# EAGLE design faboy (EAGLE 7.7.0)
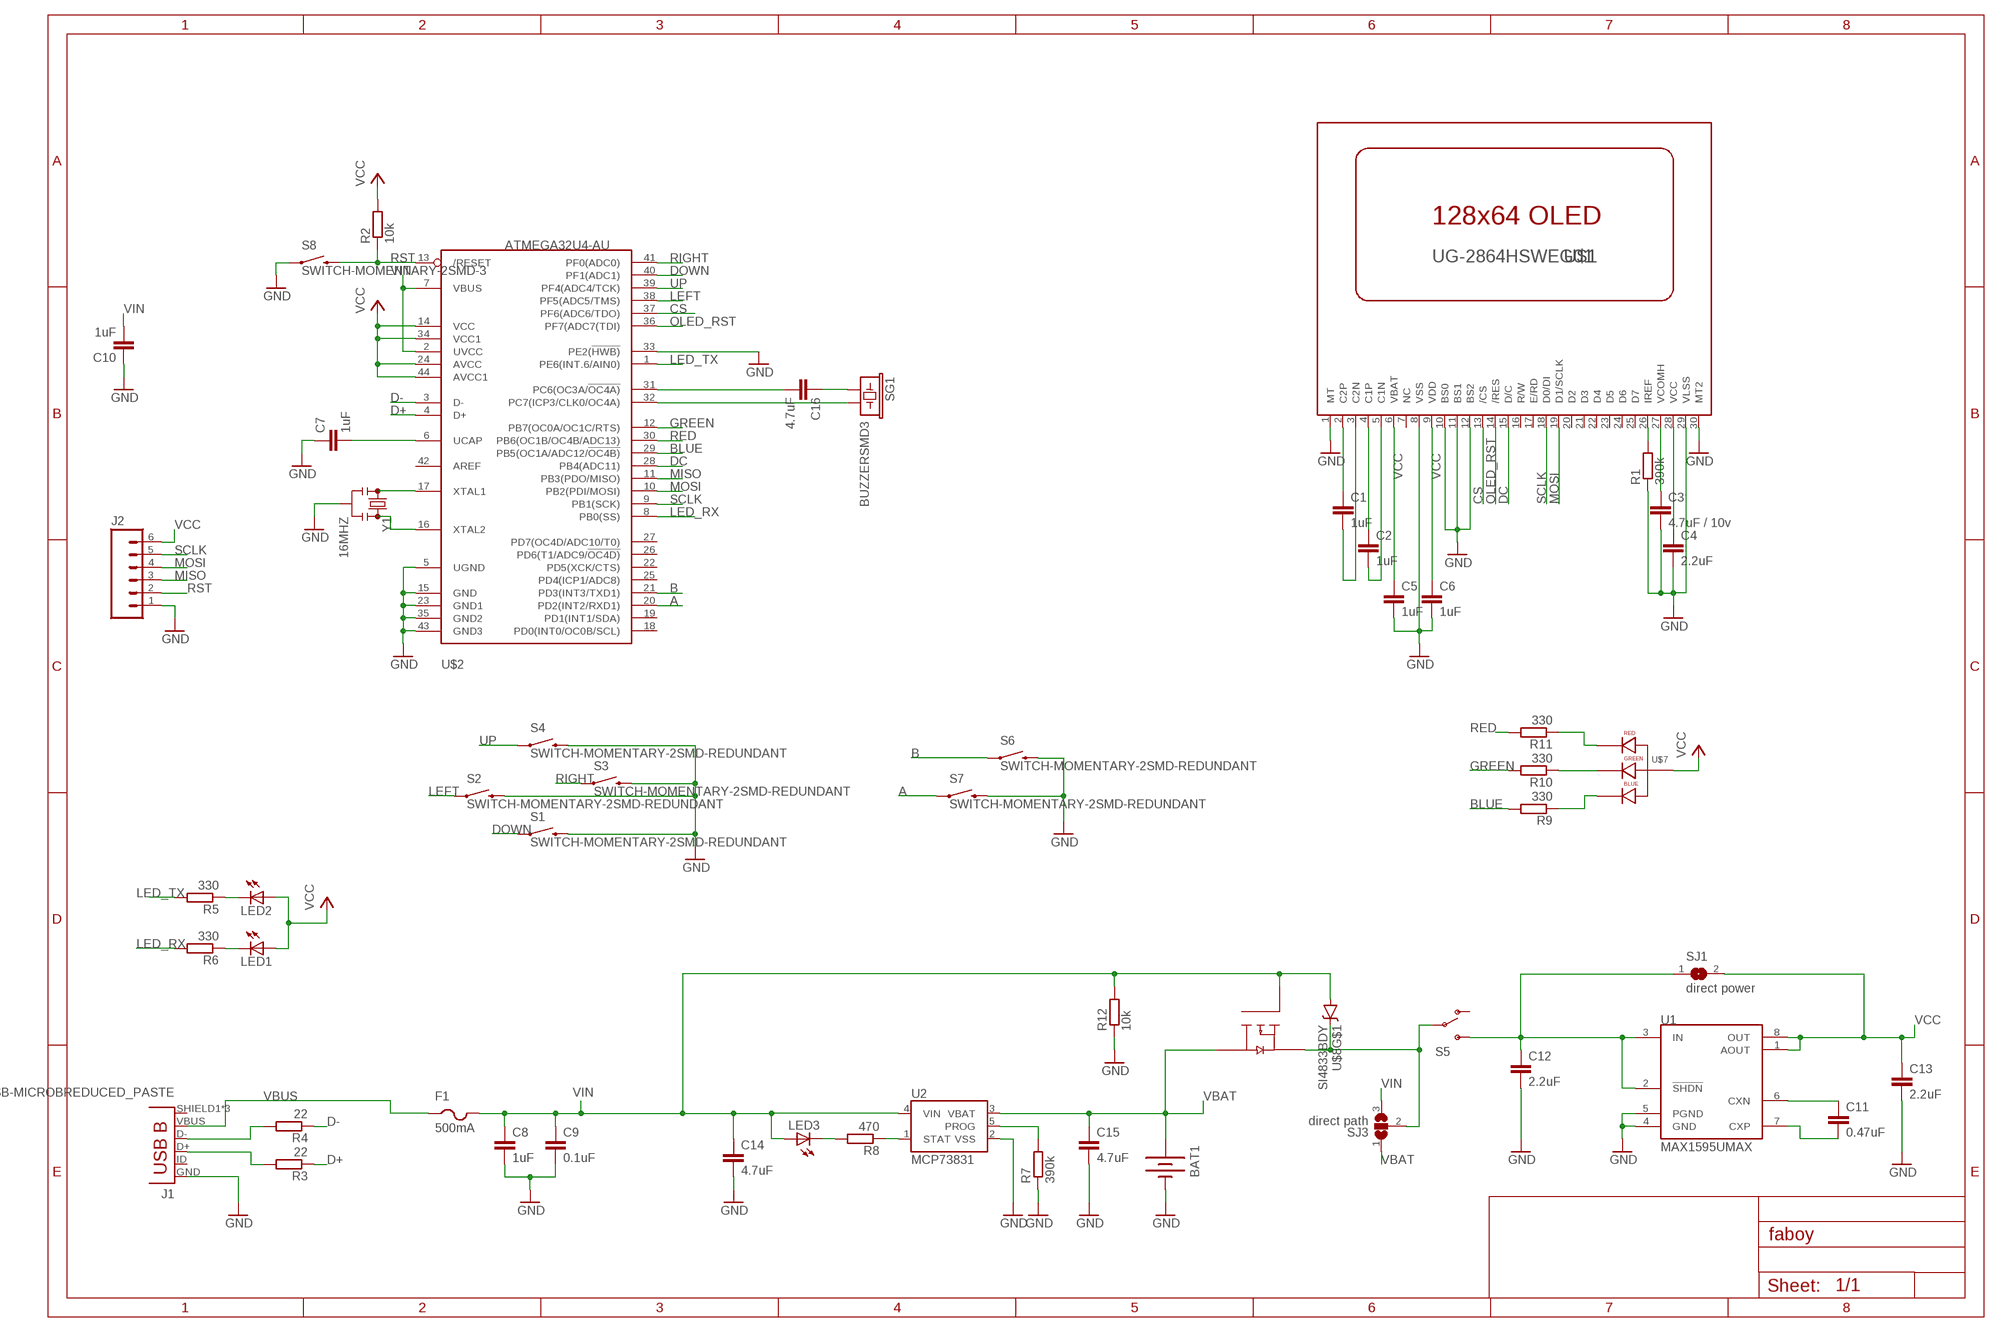
[diagram p0: schematic, sheet 1]

## Parts
BAT1  BATTERY20SMD  [BATTCON_20MM]
C1  1uF  C-EUC0805K  [C0805K]
C2  1uF  C-EUC0805K  [C0805K]
C3  4.7uF / 10v  C-EUC0805K  [C0805K]
C4  2.2uF  C-EUC0805K  [C0805K]
C5  1uF  C-EUC0805K  [C0805K]
C6  1uF  C-EUC0805K  [C0805K]
C7  1uF  C-EUC0805K  [C0805K]
C8  1uF  C-EUC0805K  [C0805K]
C9  0.1uF  C-EUC0805K  [C0805K]
C10  1uF  C-EUC0805K  [C0805K]
C11  0.47uF  C-EUC0805K  [C0805K]
C12  2.2uF  C-EUC0805K  [C0805K]
C13  2.2uF  C-EUC0805K  [C0805K]
C14  4.7uF  C-EUC0805K  [C0805K]
C15  4.7uF  C-EUC0805K  [C0805K]
C16  4.7uF  C-EUC0805K  [C0805K]
F1  500mA  PTCFUSE-1812  [1812]
J1  USB-MICROBREDUCED_PASTE  [USB-B-MICRO-SMD_V03_RED_PASTE]
J2  M06SMD-FEMALE-V2  [1X06-SMD-FEMALE-V2]
LED1  LEDSML0805  [SML0805]
LED2  LEDSML0805  [SML0805]
LED3  LEDSML0805  [SML0805]
R1  390k  R-EU_R0805  [R0805]
R2  10k  R-EU_R0805  [R0805]
R3  22  R-EU_R0805  [R0805]
R4  22  R-EU_R0805  [R0805]
R5  330  R-EU_R0805  [R0805]
R6  330  R-EU_R0805  [R0805]
R7  390k  R-EU_R0805  [R0805]
R8  470  R-EU_R0805  [R0805]
R9  330  R-EU_R0805  [R0805]
R10  330  R-EU_R0805  [R0805]
R11  330  R-EU_R0805  [R0805]
R12  10k  R-EU_R0805  [R0805]
S1  SWITCH-MOMENTARY-2SMD-REDUNDANT  [TACTILE-SWITCH-SMD]
S2  SWITCH-MOMENTARY-2SMD-REDUNDANT  [TACTILE-SWITCH-SMD]
S3  SWITCH-MOMENTARY-2SMD-REDUNDANT  [TACTILE-SWITCH-SMD]
S4  SWITCH-MOMENTARY-2SMD-REDUNDANT  [TACTILE-SWITCH-SMD]
S5  SWITCH-SPDT-SMD-A  [SWITCH-SPST-SMD-A]
S6  SWITCH-MOMENTARY-2SMD-REDUNDANT  [TACTILE-SWITCH-SMD]
S7  SWITCH-MOMENTARY-2SMD-REDUNDANT  [TACTILE-SWITCH-SMD]
S8  SWITCH-MOMENTARY-2SMD-3  [TACTILE_SWITCH_SMD-3]
SG1  BUZZERSMD3  [BUZZER-CMT1102]
SJ1  direct power  SJ  [SJ]
SJ3  direct path  SJ2W  [SJ_2]
U1  MAX1595UMAX  [UMAX8]
U2  MCP73831  [SOT23-5]
U$1  UG-2864HSWEG01  [1X30-0.7MM]
U$2  ATMEGA32U4-AU  [TQFP44]
U$7  LED-RGB-P-LCC-4  [P-LCC-4-3]
U$8  SI4833BDY  [SO08]
Y1  16MHZ  RESONATOR16MHZ  [RESONATOR-SMD]

## Nets
A: S7.1 S7.2 U$2.20(PD2(INT2/RXD1))
B: S6.1 S6.2 U$2.21(PD3(INT3/TXD1))
BLUE: R9.2 U$2.29(PB5(OC1A/ADC12/!OC4B))
CS: U$1.13(/CS) U$2.37(PF6(ADC6/TDO))
D+: R3.1 U$2.4(D+)
D-: R4.1 U$2.3(D-)
DC: U$1.15(D/C) U$2.28(PB4(ADC11))
DOWN: S1.1 S1.2 U$2.40(PF1(ADC1))
GND: BAT1.2(-) C3.2 C4.2 C5.2 C6.2 C7.1 C8.2 C9.2 C10.1 C12.2 C13.2 C14.2 C15.2 J1.GND J2.1 R1.1 R7.1 R12.1 S1.3 S1.4 S2.3 S2.4 S3.3 S3.4 S4.3 S4.4 S6.3 S6.4 S7.3 S7.4 S8.1 U1.4(GND) U1.5(PGND) U2.2(VSS) U$1.1(MT) U$1.8(VSS) U$1.10(BS0) U$1.11(BS1) U$1.12(BS2) U$1.29(VLSS) U$1.30(MT2) U$2.5(UGND) U$2.15(GND) U$2.23(GND1) U$2.33(PE2(!HWB)) U$2.35(GND2) U$2.43(GND3) Y1.2
GREEN: R10.2 U$2.12(PB7(OC0A/OC1C/RTS))
LED_RX: R6.2 U$2.8(PB0(SS))
LED_TX: R5.2 U$2.1(PE6(INT.6/AIN0))
LEFT: S2.1 S2.2 U$2.38(PF5(ADC5/TMS))
MISO: J2.3 U$2.11(PB3(PDO/MISO))
MOSI: J2.4 U$1.19(D1/SCLK) U$2.10(PB2(PDI/MOSI))
N$1: C1.1 U$1.2(C2P)
N$2: C1.2 U$1.3(C2N)
N$3: C2.1 U$1.4(C1P)
N$4: C2.2 U$1.5(C1N)
N$5: R1.2 U$1.26(IREF)
N$6: R11.1 U$7.1(RED_CATHODE)
N$7: C3.1 U$1.27(VCOMH)
N$8: C4.1 U$1.28(VCC)
N$9: C7.2 U$2.6(UCAP)
N$10: C12.1 S5.3(S) SJ1.1 U1.2(!SHDN) U1.3(IN)
N$11: U$2.17(XTAL1) Y1.1
N$12: J1.D+ R3.2
N$13: J1.D- R4.2
N$14: U$2.16(XTAL2) Y1.3
N$15: C11.1 U1.6(CXN)
N$16: C11.2 U1.7(CXP)
N$17: R8.1 U2.1(STAT)
N$18: LED3.C R8.2
N$19: R7.2 U2.5(PROG)
N$20: C16.2 U$2.31(PC6(OC3A/!OC4A))
N$21: C16.1 SG1.1
N$22: R10.1 U$7.4(GREEN_CATHODE)
N$23: LED2.C R5.1
N$24: R9.1 U$7.3(BLUE_CATHODE)
N$25: LED1.C R6.1
N$26: SG1.2 U$2.32(PC7(ICP3/CLK0/OC4A))
N$28: S5.2(P) SJ3.2 U$8.3(S2) U$8.7(C) U$8.8(C)
OLED_RST: U$1.14(/RES) U$2.36(PF7(ADC7(TDI))
RED: R11.2 U$2.30(PB6(OC1B/OC4B/ADC13))
RIGHT: S3.1 S3.2 U$2.41(PF0(ADC0))
RST: J2.2 R2.1 S8.4 U$2.13(/RESET)
SCLK: J2.5 U$1.18(D0/DI) U$2.9(PB1(SCK))
UP: S4.1 S4.2 U$2.39(PF4(ADC4/TCK))
VBAT: BAT1.1(+) C15.1 SJ3.1 U2.3(VBAT) U$8.5(D2) U$8.6(D2)
VBUS: F1.1 J1.VBUS
VCC: C5.1 C6.1 C13.1 J2.6 LED1.A LED2.A R2.2 SJ1.2 U1.1(AOUT) U1.8(OUT) U$1.6(VBAT) U$1.9(VDD) U$2.14(VCC) U$2.24(AVCC) U$2.34(VCC1) U$2.44(AVCC1) U$7.2(ANODE)
VIN: C8.1 C9.1 C10.2 C14.1 F1.2 LED3.A R12.2 SJ3.3 U2.4(VIN) U$2.2(UVCC) U$2.7(VBUS) U$8.1(A) U$8.2(A) U$8.4(G2)
Unconnected: J1.ID(USBID) J1.SHIELD1(SHIELD) J1.SHIELD2(SHIELD) J1.SHIELD3(SHIELD) S5.1(O) U$1.7(NC) U$1.16(R/W) U$1.17(E/RD) U$1.20(D2) U$1.21(D3) U$1.22(D4) U$1.23(D5) U$1.24(D6) U$1.25(D7) U$2.18(PD0(INT0/OC0B/SCL)) U$2.19(PD1(INT1/SDA)) U$2.22(PD5(XCK/CTS)) U$2.25(PD4(ICP1/ADC8)) U$2.26(PD6(T1/ADC9/!OC4D)) U$2.27(PD7(OC4D/ADC10/T0)) U$2.42(AREF)

## Library data of the parts
BAT1 = SparkFun-Electromechanical:BATTERY: Battery Holders Various common sizes : AA, AAA, 18650 (PRT-12895), 20mm coin cell and 12mm coin cell. 20MM_4LEGS, BATT-10373
C1-C16 = resistor:C-EU: CAPACITOR, European symbol
F1 = adafruit:PTCFUSE: PTC fuses, resettable thermistors
J1 = SparkFun-Connectors:USB-MICROB: RED_PASTE version has 70% paste area under D+ D- USBID pins for applications where those pins aren't required, to reduce the likelihood of bridges.; PROD_ID: CONN-11752
J2 = SparkFun-Connectors:M06: Header 6 Standard 6-pin 0.1" header. Use with straight break away headers (SKU : PRT-00116), right angle break away headers (PRT-00553), swiss pins (PRT-00743), machine pins (PRT-00117), and female headers (PRT-00115). Molex polarized connector foot print use with SKU : PRT-08094 with associated crimp pins and housings. NOTES ON THE VARIANTS LOCK and LOCK_LONGPADS... This footprint was designed to help hold the alignment of a through-hole component (i.e. 6-pin header) while soldering it into place. You may notice that each hole has been shifted either up or down by 0.005 of an inch from it's more standard position (which is a perfectly straight line). This slight alteration caused the pins (the squares in the middle) to touch the edges of the holes. Because they are alternating, it causes a "brace" to hold the component in place. 0.005 has proven to be the perfect amount of "off-center" position when using our standard breakaway headers. Although looks a little odd when you look at the bare footprint, once you have a header in there, the alteration is very hard to notice. Also,if you push a header all the way into place, it is covered up entirely on the bottom side. This idea of altering the position of holes to aid alignment will be further integrated into the Sparkfun Library for other footprints. It can help hold any component with 3 or more connection pins.; PROD_ID: CONN-09668
LED1-LED3 = led:LED: LED OSRAM: - CHIPLED LG R971, LG N971, LY N971, LG Q971, LY Q971, LO R971, LY R971 LH N974, LH R974 LS Q976, LO Q976, LY Q976 LO Q996 - Hyper CHIPLED LW Q18S LB Q993, LB Q99A, LB R99A - SideLED LS A670, LO A670, LY A670, LG A670, LP A670 LB A673, LV A673, LT A673, LW A673 LH A674 LY A675 LS A676, LA A676, LO A676, LY A676, LW A676 LS A679, LY A679, LG A679 - Hyper Micro SIDELED® LS Y876, LA Y876, LO Y876, LY Y876 LT Y87S - SmartLED LW L88C, LW L88S LB L89C, LB L89S, LG L890 LS L89K, LO L89K, LY L89K LS L896, LA L896, LO L896, LY L896 - TOPLED LS T670, LO T670, LY T670, LG T670, LP T670 LSG T670, LSP T670, LSY T670, LOP T670, LYG T670 LG T671, LOG T671, LSG T671 LB T673, LV T673, LT T673, LW T673 LH T674 LS T676, LA T676, LO T676, LY T676, LB T676, LH T676, LSB T676, LW T676 LB T67C, LV T67C, LT T67C, LS T67K, LO T67K, LY T67K, LW E67C LS E67B, LA E67B, LO E67B, LY E67B, LB E67C, LV E67C, LT E67C LW T67C LS T679, LY T679, LG T679 LS T770, LO T770, LY T770, LG T770, LP T770 LB T773, LV T773, LT T773, LW T773 LH T774 LS E675, LA E675, LY E675, LS T675 LS T776, LA T776, LO T776, LY T776, LB T776 LHGB T686 LT T68C, LB T68C - Hyper Mini TOPLED® LB M676 - Mini TOPLED Santana® LG M470 LS M47K, LO M47K, LY M47K Source: http://www.osram.convergy.de LUXEON: - LUMILED® LXK2-PW12-R00, LXK2-PW12-S00, LXK2-PW14-U00, LXK2-PW14-V00 LXK2-PM12-R00, LXK2-PM12-S00, LXK2-PM14-U00 LXK2-PE12-Q00, LXK2-PE12-R00, LXK2-PE12-S00, LXK2-PE14-T00, LXK2-PE14-U00 LXK2-PB12-K00, LXK2-PB12-L00, LXK2-PB12-M00, LXK2-PB14-N00, LXK2-PB14-P00, LXK2-PB14-Q00 LXK2-PR12-L00, LXK2-PR12-M00, LXK2-PR14-Q00, LXK2-PR14-R00 LXK2-PD12-Q00, LXK2-PD12-R00, LXK2-PD12-S00 LXK2-PH12-R00, LXK2-PH12-S00 LXK2-PL12-P00, LXK2-PL12-Q00, LXK2-PL12-R00 Source: www.luxeon.com KINGBRIGHT: KA-3528ASYC Source: www.kingbright.com
R1-R12 = resistor:R-EU_: RESISTOR, European symbol
S1-S4 S6 S7 = SparkFun-Electromechanical:SWITCH-MOMENTARY-2: Various NO switches- pushbuttons, reed, etc; PROD_ID: SWCH-08247
S5 = SparkFun-Electromechanical:SWITCH-SPDT: SPDT Switch Simple slide switch, Spark Fun Electronics SKU : COM-00102 DPDT SMT slide switch, AYZ0202, SWCH-08179; PROD_ID: SWCH-10651
S8 = SparkFun-Electromechanical:SWITCH-MOMENTARY-2: Various NO switches- pushbuttons, reed, etc
SG1 = SparkFun-Electromechanical:BUZZER: Buzzer 12mm Spark Fun Electronics SKU : Comp-Buzzer
SJ1 = jumper:SJ: SMD solder JUMPER
SJ3 = jumper:SJ2W: SMD solder JUMPER
U1 = maxim:MAX1595: max1595 buck/boost dcdc 3.3v output
U2 = SparkFun-PowerIC:MCP73831: Miniature single cell, fully integrated Li-Ion, Li-polymer charge management controller http://ww1.microchip.com/downloads/en/DeviceDoc/20001984g.pdf IC-09995; PROD_ID: IC-09995
U$1 = adafruit:UG-2864HSWEG01: UG-2864HSWEG01 OLED display
U$2 = adafruit:ATMEGA32U4: http://www.ladyada.net/library/eagle
U$7 = SparkFun-LED:LED-RGB-P-LCC-4
U$8 = SparkFun-DiscreteSemi:SI4833BDY
Y1 = SparkFun-FreqCtrl:RESONATOR: Resonator Small SMD resonator. Used, eg, on the Arduino Pro/ Pro Mini boards. 8MHz- XTAL-08895 16MHz- XTAL-08900; PROD_ID: XTAL-08900

## Board
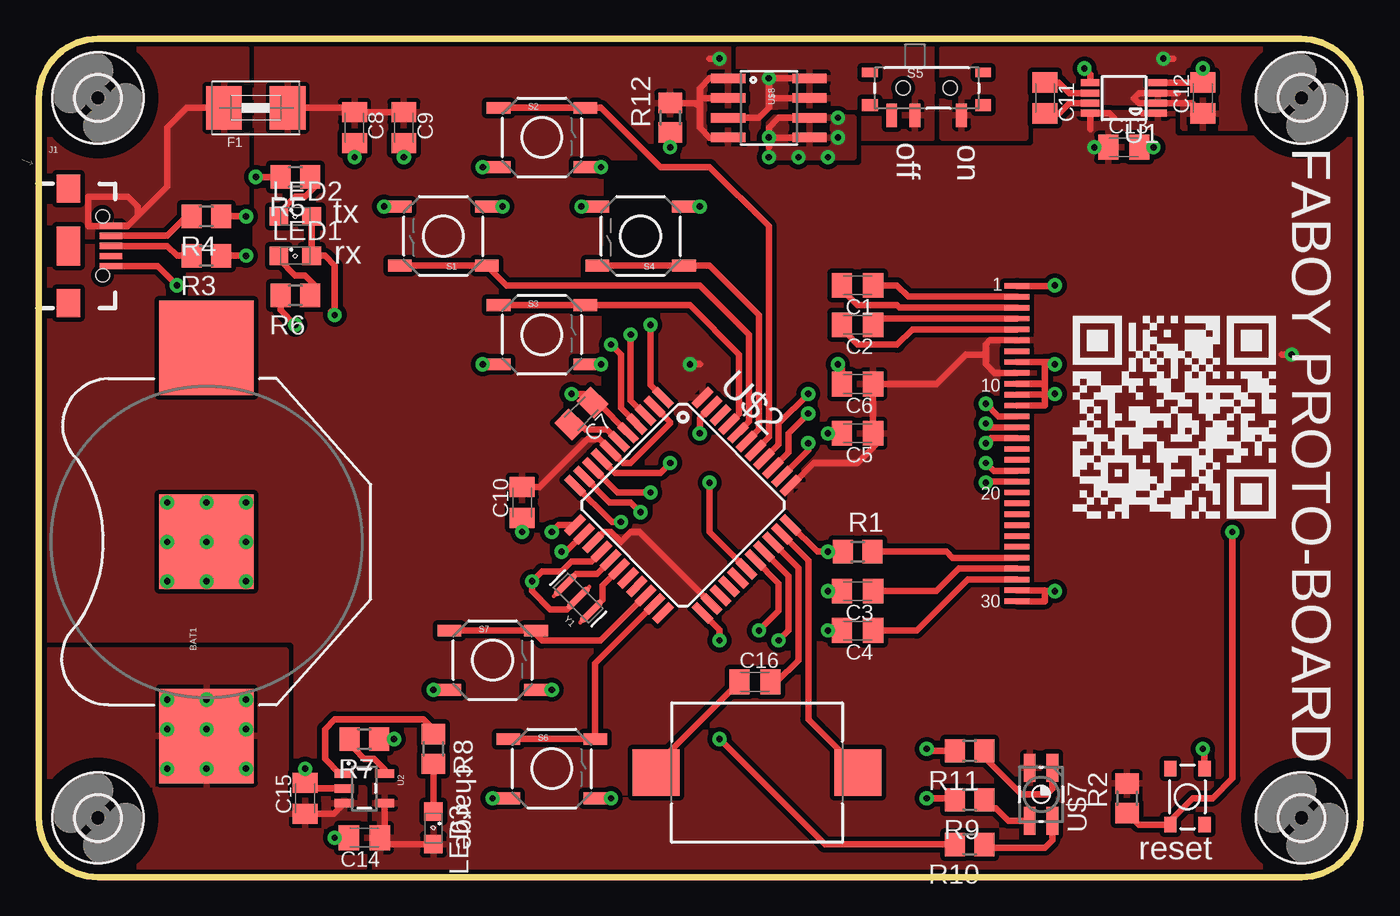
[diagram p1: board, top side]
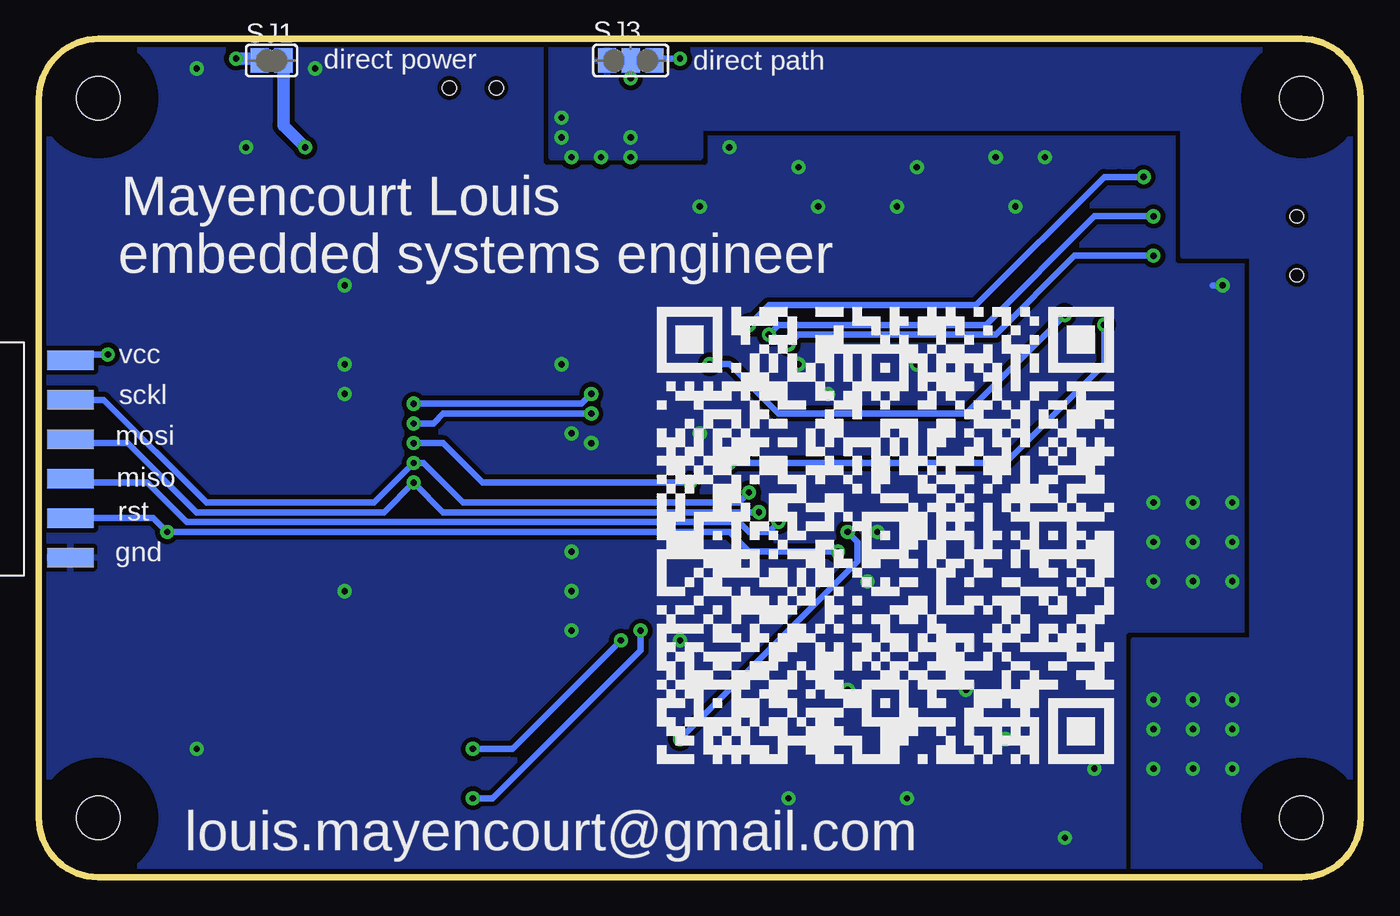
[diagram p2: board, bottom side, seen from below]

Size 85.09 x 53.98 mm. Coordinates in mm from the lower left corner, seen from the top.
Outline: 81.23,53.98 3.81,53.98 arc90 0,50.16 0,3.81 arc90 3.81,0 81.28,0 arc90 85.09,3.81 85.09,50.11 arc90 81.23,53.98
Copper layers (1*16): Top 0.035mm / dielectric 1.5mm / Bottom 0.035mm
Design rules "SparkFun": minimum track width 8mil, minimum drill 20mil, track to track 8mil, track to pad 8mil, pad to pad 8mil, via to via 8mil, smd to smd 8mil, copper to edge 8mil, drill to drill 8mil, minimum pad ring 12mil, minimum via ring 10mil, stop-mask expansion 4mil, vias tented up to drill 20mil, thermal gap 10mil

### Footprints (pad centres in the part's own frame; a part is rotated, then mirrored left to right if it is on the bottom)
BATTCON_20MM = smd 6.07 x 6.07: 1 -12.5,0; 2 0,0; 3 12.5,0
C0805K = smd 1.3 x 1.6: 1 -1,0; 2 1,0
1812 = smd 2.286 x 2.794: 1 -2.046,0; 2 2.046,0
USB-B-MICRO-SMD_V03_RED_PASTE = smd 1.45 x 0.4: D+ 2.725,0; D- 2.725,0.65; GND 2.725,-1.3; ID 2.725,-0.65; VBUS 2.725,1.3 | smd 1.5 x 1.8: SHIELD1 0,3.685; SHIELD2 0,-3.685 | smd 1.5 x 2.5: SHIELD3 0,0 | hole 0.85: 2.2,1.9; 2.2,-1.9
1X06-SMD-FEMALE-V2 = smd 1.25 x 3: 1 6.35,3.425; 2 3.81,3.425; 3 1.27,3.425; 4 -1.27,3.425; 5 -3.81,3.425; 6 -6.35,3.425
SML0805 = smd 1.2 x 1.2: A 1.05,0; C -1.05,0
R0805 = smd 1.3 x 1.5: 1 -0.95,0; 2 0.95,0
TACTILE-SWITCH-SMD = smd 1.524 x 0.762: 1 -2.794,1.905; 2 2.794,1.905; 3 -2.794,-1.905; 4 2.794,-1.905
SWITCH-SPST-SMD-A = smd 0.7 x 1.5: 1 -2.25,-1.75; 2 -0.75,-1.75; 3 2.25,-1.75 | smd 1 x 0.6: GND1 -3.65,1; GND3 3.65,1 | smd 1 x 0.8: GND2 -3.65,-1.1; GND4 3.65,-1.1 | hole 0.9: -1.5,0; 1.5,0
TACTILE_SWITCH_SMD-3 = smd 1 x 0.8: 1 -1.8,1.1; 2 1.8,1.1; 3 -1.8,-1.1; 4 1.8,-1.1
BUZZER-CMT1102 = smd 3 x 3: 1 -6.5,0; 2 6.5,0
SJ = smd 1.168 x 1.6: 1 -0.762,0; 2 0.762,0
SJ_2 = smd 1.168 x 1.6: 1 -1.524,0; 2 0,0; 3 1.524,0
UMAX8 = smd 0.45 x 1.2: 1 -0.975,-2.175; 2 -0.325,-2.175; 3 0.325,-2.175; 4 0.975,-2.175; 5 0.975,2.175; 6 0.325,2.175; 7 -0.325,2.175; 8 -0.975,2.175
SOT23-5 = smd 0.55 x 1.2: 1 -0.95,-1.3; 2 0,-1.3; 3 0.95,-1.3; 4 0.95,1.3; 5 -0.95,1.3
1X30-0.7MM = smd 0.35 x 1.6: 1 -10.15,0; 2 -9.45,0; 3 -8.75,0; 4 -8.05,0; 5 -7.35,0; 6 -6.65,0; 7 -5.95,0; 8 -5.25,0; 9 -4.55,0; 10 -3.85,0; 11 -3.15,0; 12 -2.45,0; 13 -1.75,0; 14 -1.05,0; 15 -0.35,0; 16 0.35,0; 17 1.05,0; 18 1.75,0; 19 2.45,0; 20 3.15,0; 21 3.85,0; 22 4.55,0; 23 5.25,0; 24 5.95,0; 25 6.65,0; 26 7.35,0; 27 8.05,0; 28 8.75,0; 29 9.45,0; 30 10.15,0
TQFP44 = smd 1.5 x 0.5: 1 -5.8,4; 2 -5.8,3.2; 3 -5.8,2.4; 4 -5.8,1.6; 5 -5.8,0.8; 6 -5.8,0; 7 -5.8,-0.8; 8 -5.8,-1.6; 9 -5.8,-2.4; 10 -5.8,-3.2; 11 -5.8,-4; 23 5.8,-4; 24 5.8,-3.2; 25 5.8,-2.4; 26 5.8,-1.6; 27 5.8,-0.8; 28 5.8,0; 29 5.8,0.8; 30 5.8,1.6; 31 5.8,2.4; 32 5.8,3.2; 33 5.8,4 | smd 0.5 x 1.5: 12 -4,-5.8; 13 -3.2,-5.8; 14 -2.4,-5.8; 15 -1.6,-5.8; 16 -0.8,-5.8; 17 0,-5.8; 18 0.8,-5.8; 19 1.6,-5.8; 20 2.4,-5.8; 21 3.2,-5.8; 22 4,-5.8; 34 4,5.8; 35 3.2,5.8; 36 2.4,5.8; 37 1.6,5.8; 38 0.8,5.8; 39 0,5.8; 40 -0.8,5.8; 41 -1.6,5.8; 42 -2.4,5.8; 43 -3.2,5.8; 44 -4,5.8
2,8 = hole 2.8: 0,0
P-LCC-4-3 = smd 0.75 x 1.8: 1 0.725,1.7; 2 -0.725,1.7; 3 -0.725,-1.7; 4 0.725,-1.7
SO08 = smd 0.61 x 2.21: 1 -1.905,-2.616; 2 -0.635,-2.616; 3 0.635,-2.616; 4 1.905,-2.616; 5 1.905,2.616; 6 0.635,2.616; 7 -0.635,2.616; 8 -1.905,2.616
RESONATOR-SMD = smd 0.45 x 1.905: 1 -1.2,0; 2 0,0; 3 1.2,0

### Placement (x,y rotation side)
BAT1  10.79,21.59 90 top
C1  52.7,38.1 180 top
C2  52.7,35.56 180 top
C3  52.7,18.41 180 top
C4  52.7,15.88 180 top
C5  52.7,28.57 180 top
C6  52.7,31.75 180 top
C7  34.92,29.84 225 top
C8  20.32,48.26 270 top
C9  23.5,48.26 270 top
C10  31.11,24.13 90 top
C11  64.77,50.16 270 top
C12  74.93,50.16 90 top
C13  69.85,46.99 0 top
C14  20.95,2.54 180 top
C15  17.14,5.08 90 top
C16  46.1,12.57 0 top
F1  13.97,49.53 0 top
J1  1.91,40.64 0 top
J2  86.49,26.92 270 bottom
LED1  16.51,40.01 0 top
LED2  16.51,42.55 0 top
LED3  25.4,3.17 270 top
R1  52.7,20.95 0 top
R2  70.05,5.08 90 top
R3  10.79,40.01 180 top
R4  10.79,42.55 180 top
R5  820  [R0805]  16.51,45.09 180 top
R6  820  [R0805]  16.51,37.47 180 top
R7  20.95,8.89 180 top
R8  25.4,8.26 270 top
R9  820  [R0805]  59.92,4.98 180 top
R10  820  [R0805]  59.92,2.11 180 top
R11  820  [R0805]  59.92,8.13 180 top
R12  40.64,48.9 90 top
S1  26.04,41.27 180 top
S2  32.38,47.62 0 top
S3  32.38,34.92 0 top
S4  38.73,41.27 180 top
S5  57.15,50.8 0 top
S6  33.02,6.99 0 top
S7  29.21,13.97 0 top
S8  73.94,5.18 270 top
SG1  46.23,6.73 0 top
SJ1  70.1,52.58 0 bottom
SJ3  46.99,52.58 0 bottom
U1  69.85,50.16 90 top
U2  20.95,5.71 270 top
U$1  62.97,27.91 270 top
U$2  41.46,23.94 315 top
U$3  [2,8]  81.28,50.16 270 top
U$4  [2,8]  81.28,3.81 270 top
U$5  gnd  [2,8]  3.81,50.16 270 top
U$6  [2,8]  3.81,3.81 270 top
U$7  64.52,5.33 0 top
U$8  46.99,49.53 270 top
Y1  34.72,17.97 135 top

### Tracks (layer width: path | path; a pad name or v marks a point on that pad's centre or on a via)
A
  Top 0.406: S7.1 S7.2 32,15.62 32.38,15.24 36.15,15.24 U$2.20
B
  Top 0.406: S6.1 S6.2 35.81,13.77 U$2.21
BLUE  (via drill 0.4)
  Top 0.406: v46.35,15.88 47.62,17.14 47.62,18.91 U$2.29 | v57.15,5.08 58.87,5.08 R9.2
  Bottom 0.406: v46.35,15.88 46.35,14.61 55.88,5.08 v57.15,5.08
CS  (via drill 0.4)
  Top 0.406: U$2.37 47.62,27.84 47.62,29.21 v49.53,31.11 | v60.96,30.48 61.77,29.66 U$1.13
  Bottom 0.406: v49.53,31.11 50.16,30.48 v60.96,30.48
D+  (via drill 0.4)
  Top 0.406: U$2.4 37.47,30.2 37.47,33.66 v36.83,34.29 | v13.34,40.01 R3.1
  Bottom 0.406: v36.83,34.29 36.2,34.92 23.5,34.92 18.41,40.01 v13.34,40.01
D-  (via drill 0.4)
  Top 0.406: U$2.3 38.1,30.7 v38.1,34.92 | v13.34,42.55 R4.1
  Bottom 0.406: v38.1,34.92 37.47,35.56 24.13,35.56 17.14,42.55 v13.34,42.55
DC  (via drill 0.4)
  Top 0.406: U$2.28 43.18,22.23 v43.18,25.4 | v60.96,27.94 61.28,28.27 U$1.15
  Bottom 0.406: v43.18,25.4 56.52,25.4 59.05,27.94 v60.96,27.94
DOWN
  Top 0.406: S1.2 S1.1 30.1,38.1 42.55,38.1 45.72,34.92 45.72,29.33 U$2.40
GND  (via drill 0.4)
  Top 0.406: U$1.30 64.75,17.77 64.77,17.78 64.77,18.41 | 64.77,18.41 64.72,18.46 U$1.29 | U$1.8 64.77,33.16 | 64.77,33.16 64.77,31.75 | 64.77,31.75 62.97,31.75 U$1.10 64.75,31.77 64.77,31.75 | U$1.11 64.77,31.07 | U$1.12 64.77,30.36 64.77,31.07 | U1.4 74.64,51.14 | C12.2 74.91,51.14 74.64,51.14 | 64.77,18.41 v65.41,18.41 | C13.2 v71.75,46.99 | 74.64,51.14 arc90 v74.93,52.07 | 64.77,31.07 64.82,31.11 v65.41,31.11 64.77,31.11 64.77,31.75 | 64.77,33.16 65.26,33.16 v65.41,33.02 | 34.01,17.25 32.92,17.25 31.75,18.41 v31.75,19.05 32.38,19.68 33.66,19.68 34.29,20.32 35.57,20.32 U$2.15 | C10.1 v31.11,22.23 | C7.1 35.63,30.41 | U1.5 67.67,51.7 v67.31,52.07 | C8.2 v20.32,46.35 | S2.4 v36.2,45.72 | S2.3 v28.57,45.72 | S6.3 v29.21,5.08 | S6.4 v36.83,5.08 | S1.4 v22.23,43.18 | S1.3 v29.84,43.18 | S4.4 v34.92,43.18 | S4.3 v42.55,43.18 | v28.57,33.02 S3.3 | v36.2,33.02 S3.4 | S7.3 v25.4,12.06 | S7.4 v33.02,12.06 | C7.1 35.07,31.11 v34.29,31.11 | C6.2 51.7,32.75 v51.44,33.02 | U$1.1 65.37,38.06 v65.41,38.1 | C3.2 v50.8,18.41 | R1.1 v50.8,20.95 50.11,20.95 U$2.33 | C4.2 v50.8,15.88 | C9.2 v23.5,46.35 | S8.1 75.04,8.15 v74.93,8.26 | U2.2 17.51,5.71 C15.2 v17.14,6.99 | C14.2 v19.05,2.54 | R7.1 v22.86,8.89 | U$2.35 49.53,27.49 v49.53,27.94 | C5.2 v50.8,28.57 | U$2.5 35.98,30.55 C7.1 | U$2.23 43.81,15.93 v43.81,15.24 | R12.1 v40.64,46.99 | U$2.43 42.55,29.55 v42.55,28.57 | J1.GND 7.65,39.34 v8.89,38.1
  Bottom 0.406: v42.55,28.57 42.55,27.94 | v8.89,38.1 9.53,38.1
  other vias: 8.26,24.13 10.79,24.13 13.34,24.13 13.34,21.59 13.34,19.05 10.79,21.59 8.26,21.59 10.79,19.05 8.26,19.05
  pour Bottom (isolate 0.305, rank 2): 0.64,53.34 84.45,53.34 84.45,0.64 0.64,0.64
  pour Bottom (isolate 0.305, rank 2): 0.64,53.34 84.45,53.34 84.45,0.64 0.64,0.64
GREEN  (via drill 0.4)
  Top 0.406: U$2.12 33.47,22.67 v33.02,22.23 | v43.81,8.89 50.6,2.11 R10.2
  Bottom 0.406: v33.02,22.23 32.38,21.59 32.38,20.32 v43.81,8.89
LED_RX  (via drill 0.4)
  Top 0.406: U$2.8 37.11,26.04 40.01,26.04 v40.64,26.67 | R6.2 15.56,36.51 v16.51,35.56
  Bottom 0.406: v40.64,26.67 22.86,26.67 16.51,33.02 v16.51,35.56
LED_TX  (via drill 0.4)
  Top 0.406: U$2.1 39.37,31.69 v39.37,35.56 | 15.56,45.41 R5.2 v13.97,45.09
  Bottom 0.406: v39.37,35.56 38.1,36.83 24.77,36.83 16.51,45.09 R5.2 v13.97,45.09
LEFT
  Top 0.406: S2.1 S2.2 36.2,49.53 40.01,45.72 43.18,45.72 46.99,41.91 46.99,28.34 U$2.38
MISO  (via drill 0.4)
  Top 0.406: U$2.11 36.89,22.86 v37.47,22.86
  Bottom 0.406: v37.47,22.86 38.1,22.23 39.37,22.23 40.01,22.86 75.56,22.86 78.11,25.4 82.81,25.4 J2.3
MOSI  (via drill 0.4)
  Top 0.406: U$2.10 36.75,24.13 38.1,24.13 v38.73,23.5 | v60.96,25.4 61.02,25.46 U$1.19
  Bottom 0.406: v38.73,23.5 59.05,23.5 v60.96,25.4 62.87,23.5 74.93,23.5 79.38,27.94 82.81,27.94 J2.4
N$1
  Top 0.406: U$1.2 55.98,37.37 55.24,38.1 C1.1
N$2
  Top 0.406: U$1.3 55.41,36.66 55.24,36.83 52.7,36.83 51.7,37.83 C1.2
N$3
  Top 0.406: U$1.4 54.11,35.97 C2.1
N$4
  Top 0.406: U$1.5 56.22,35.27 55.24,34.29 52.7,34.29 52.07,34.92 52.07,35.2 C2.2
N$5
  Top 0.406: U$1.26 58.81,20.57 58.42,20.95 R1.2
N$6
  Top 0.406: U$7.1 65.24,5.68 64.9,5.33 63.25,5.33 60.96,7.62 60.96,8.04 R11.1
N$7
  Top 0.406: U$1.27 59.23,19.86 57.78,18.41 C3.1
N$8
  Top 0.406: U$1.28 59.8,19.16 56.52,15.88 C4.1
N$9
  Top 0.406: U$2.6 36.58,28.83 35.18,28.83 34.87,29.14 C7.2
N$10  (via drill 0.4)
  Top 0.406: C12.1 74.25,49.84 U1.2 70.81,49.84 70.48,50.16 70.81,50.49 U1.3 73.33,50.49 | v72.39,52.7 73.03,52.7
  Bottom 0.813: SJ1.1 70.99,52.7 v72.39,52.7
  pour Top (isolate 0.305): 58.17,53.34 80.01,53.34 80.01,48.26 73.66,48.26 73.66,49.91 63.5,49.91 63.5,47.62 58.17,47.62
N$11
  Top 0.406: U$2.17 36.29,18.77 36.29,17.84
N$12
  Top 0.406: J1.D+ 8.26,40.64 8.89,40.01 R3.2
N$13
  Top 0.406: J1.D- 8.27,41.29 9.53,42.55 R4.2
N$14
  Top 0.406: U$2.16 35.92,19.53 34.59,19.53
N$15
  Top 0.406: U1.6 66.35,50.49 65.67,51.16 C11.1
N$16
  Top 0.406: U1.7 66.35,49.84 65.67,49.16 C11.2
N$17
  Top 0.406: U2.1 19.37,6.67 18.41,7.62 18.41,9.53 19.05,10.16 24.77,10.16 25.4,9.53 R8.1
N$18
  Top 0.406: LED3.C R8.2
N$19
  Top 0.406: U2.5 22.25,6.96 21.59,7.62 20.95,7.62 20.32,8.26 20.32,8.57 R7.2
N$20
  Top 0.406: C16.2 47.5,12.57 48.9,13.97 48.9,19.05 48.9,19.27 48.9,19.9 U$2.31
N$21
  Top 0.406: C16.1 39.73,7.2 SG1.1
N$22
  Top 0.406: U$7.4 65.24,2.38 64.77,1.91 61.07,1.91 R10.1
N$23
  Top 0.406: LED2.C 15.46,42.77 16.51,43.81 17.14,43.81 17.78,44.45 17.78,44.77 R5.1
N$24
  Top 0.406: U$7.3 62.41,3.63 61.59,4.45 61.4,4.45 R9.1
N$25
  Top 0.406: LED1.C 15.46,39.78 16.51,38.73 17.14,38.73 17.78,38.1 17.78,37.78 R6.1
N$26
  Top 0.406: SG1.2 52.73,6.96 49.53,10.16 49.53,20.4 U$2.32
N$28  (via drill 0.4)
  Top 0.406: U$8.8 v46.99,51.44 46.99,50.16 | U$8.3 46.35,48.9 46.99,49.53 46.99,50.16 | U$8.7 46.99,50.16
  Bottom 0.406: SJ3.2 v46.99,51.44
  pour Top (isolate 0.305, rank 2): 45.09,53.34 45.09,47.62 57.53,47.62 57.53,53.34
OLED_RST  (via drill 0.4)
  Top 0.406: U$2.36 48.26,27.35 48.26,28.57 v49.53,29.84 | v60.96,29.21 61.2,28.96 U$1.14
  Bottom 0.406: v49.53,29.84 59.05,29.84 59.69,29.21 v60.96,29.21
RED  (via drill 0.4)
  Top 0.406: v47.62,15.24 48.26,15.88 48.26,18.41 48.26,18.77 48.26,19.41 U$2.30 | v57.15,8.26 57.28,8.13 R11.2
  Bottom 0.406: v47.62,15.24 54.61,8.26 v57.15,8.26
RIGHT
  Top 0.406: S3.1 S3.2 41.91,36.83 45.09,33.66 45.09,29.83 U$2.41
RST  (via drill 0.4)
  Top 0.406: U$2.13 33.95,20.95 v33.66,20.95 | R2.1 70.8,3.38 S8.4 72.84,3.62 74.3,5.08 75.56,5.08 76.83,6.35 v76.83,22.23
  Bottom 0.406: J2.2 77.72,23.11 v76.83,22.23 40.64,22.23 39.37,20.95 v33.66,20.95
SCLK  (via drill 0.4)
  Top 0.406: U$2.9 37.25,24.77 v39.37,24.77 | v60.96,26.67 61.47,26.16 U$1.18
  Bottom 0.406: v39.37,24.77 40.01,24.13 57.78,24.13 60.33,26.67 v60.96,26.67 63.5,24.13 74.3,24.13 80.9,30.73 J2.5
UP
  Top 0.406: S4.2 S4.1 43.18,39.37 46.35,36.2 46.35,28.84 U$2.39
VBAT  (via drill 0.4)
  Top 0.406: U2.3 18.97,4.08 C15.1 16.88,3.81 | v10.79,9.53 BAT1.1 | U$8.6 47.62,48.9 46.99,48.26 v46.99,47.62 | v46.99,47.62 46.99,46.99 | U$8.5 v46.99,47.62
  other vias: 8.26,11.43 10.79,11.43 13.34,11.43 8.26,6.99 10.79,6.99 13.34,6.99 13.34,9.53 8.26,9.53 51.44,48.9 51.44,47.62 50.8,46.35 46.99,46.35 48.9,46.35
  pour Bottom (isolate 0.305): 14.61,0.64 0.64,0.64 0.64,53.34 52.07,53.34 52.07,46.35 42.55,46.35 42.55,48.26 11.43,48.26 11.43,40.01 6.99,40.01 6.99,15.24 14.61,15.24
  pour Top (isolate 0.305): 0.64,14.61 15.88,14.61 15.88,5.71 20.95,5.71 20.95,0.64 0.64,0.64
  pour Top (isolate 0.305): 46.99,48.9 52.45,48.9 52.45,46.35 46.99,46.35
VBUS
  Top 0.406: J1.VBUS 5.75,41.94 6.35,42.55 6.35,43.18 5.71,43.81 3.17,43.81 3.17,41.91 5.71,41.91 8.26,44.45 8.26,48.26 9.53,49.53 F1.1
  pour Top (isolate 0.305): 13.34,53.34 0.64,53.34 0.64,41.27 13.34,41.27
VCC  (via drill 0.4)
  Top 0.406: U$1.9 61.52,32.47 60.96,33.02 60.96,33.66 | 60.96,33.66 60.96,34.29 61.23,34.56 U$1.6 | 60.96,33.66 59.69,33.66 57.78,31.75 C6.1 C5.1 53.98,28.3 53.98,27.94 52.7,26.67 49.9,26.67 48.44,25.22 U$2.34 | U1.1 71.05,49.19 | 67.67,48.16 U1.8 68.92,49.19 69.22,48.9 | 69.22,47.62 68.58,46.99 | U$2.14 36.35,22.23 36.83,22.23 37.47,21.59 38.1,22.23 38.66,22.23 U$2.24 | v80.64,33.66 80.01,33.66 | v67.94,46.99 C13.1 | 18.83,36.41 v19.05,36.2 19.05,39.37 18.41,40.01 LED1.A LED2.A | v41.91,33.02 42.55,33.02
  Bottom 0.406: J2.6 82.68,33.66 v80.64,33.66 | v19.05,36.2 25.4,29.84 37.47,29.84 40.64,33.02 v41.91,33.02
  Bottom 0.813: SJ1.2 69.34,48.39 v67.94,46.99
  pour Top (isolate 0.305, rank 3): 84.45,53.34 35.56,53.34 35.56,0.64 84.45,0.64
VIN  (via drill 0.4)
  Top 0.406: F1.2 20.05,49.53 C8.1 C9.1 | U2.4 22.25,2.84 C14.1 22.37,2.12 LED3.A | U$2.2 40.64,29.29 40.64,29.21 38.1,26.67 37.6,26.67 U$2.7 36.08,28.19 35.31,28.19 32.24,25.13 C10.2 | U$8.2 42.55,50.16 | 42.55,50.16 42.55,50.8 43.18,51.44 U$8.1 | U$8.4 43.18,47.62 42.55,48.26 42.55,49.53 | 42.55,49.53 42.55,50.16 | R12.2 42.23,49.84 42.55,49.53 | v43.81,52.7 43.18,52.7
  Bottom 0.406: SJ3.3 45.34,52.7 v43.81,52.7
  pour Top (isolate 0.305, rank 3): 20.95,0.64 20.95,7.62 16.51,7.62 16.51,12.06 0.64,12.06 0.64,40.64 13.97,40.64 13.97,53.34 45.09,53.34 45.09,46.35 36.2,46.35 35.56,0.64

### Text on the board
tPlace: off | on | FABOY PROTO-BOARD | tx | rx | charge | reset
bPlace: direct path | direct power | Mayencourt Louis | embedded systems engineer | vcc | sckl | mosi | miso | rst | gnd | louis.mayencourt@gmail.com
200bmp: /Users/mayencourtlouis/Documents/projets/faboy/pcb/qrcode_github.bmp | /Users/mayencourtlouis/Documents/projets/faboy/pcb/qrcode_github.bmp